# Altium project Digital Clock.PrjPcb
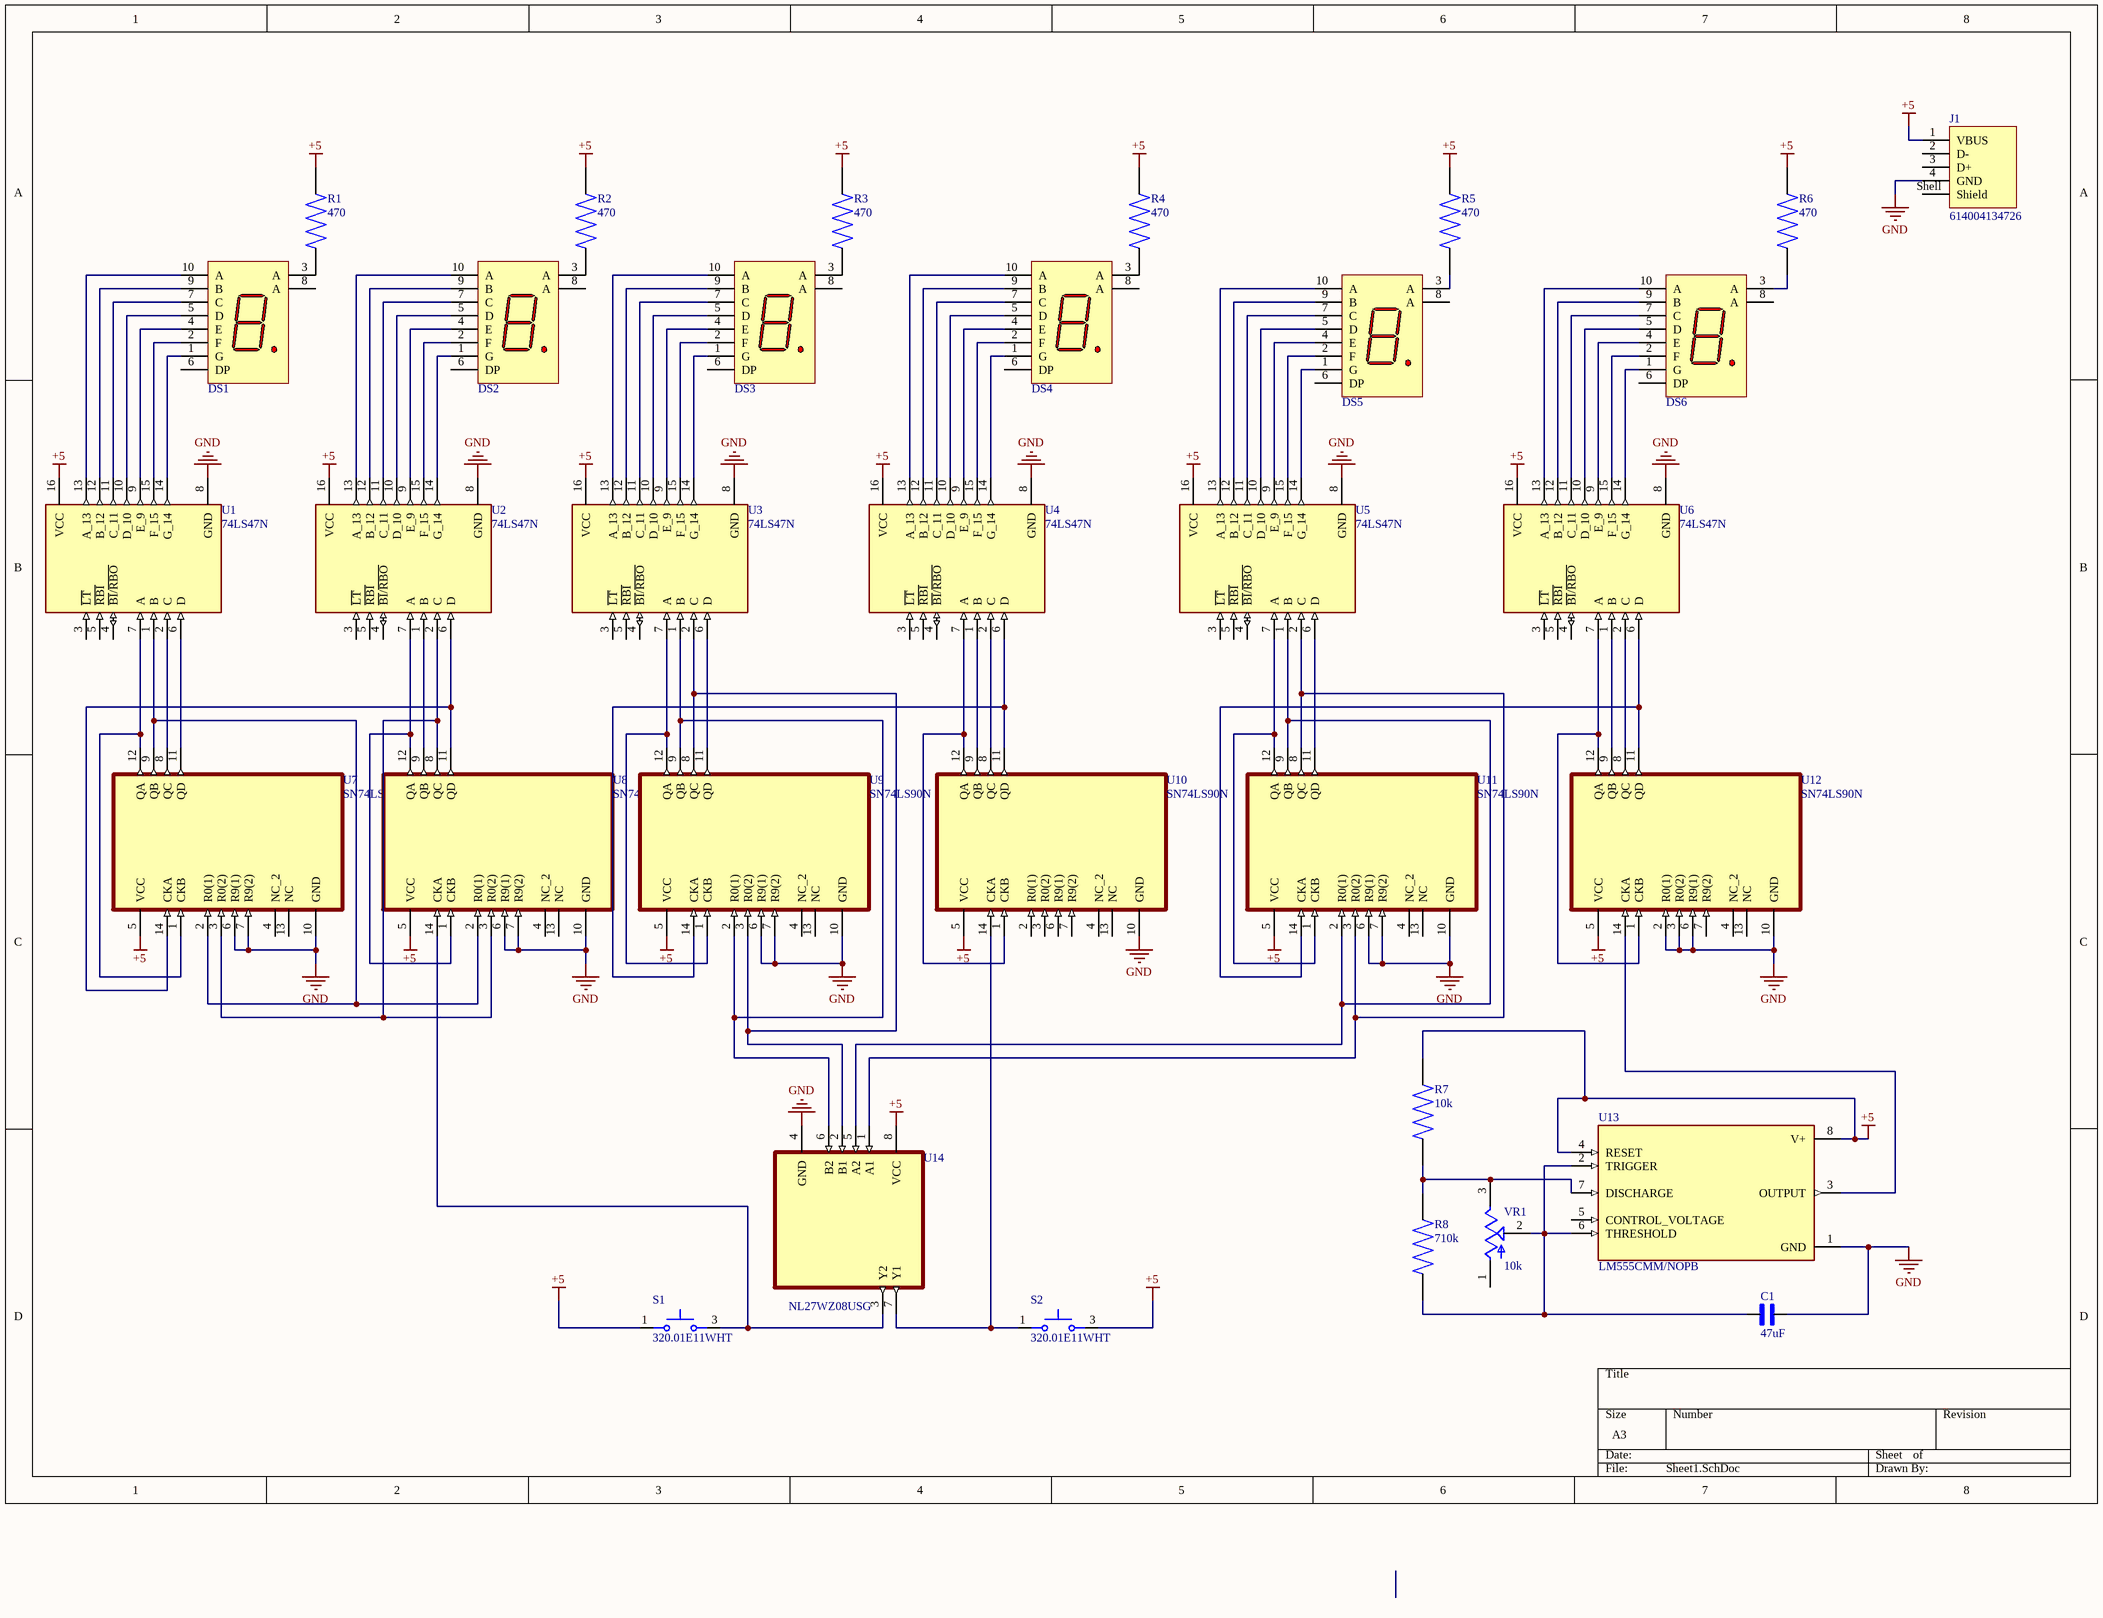
[diagram p0: Sheet1.SchDoc]
1 sheet, 33 parts. Net scope: global (net labels, ports and power ports of the same name join across sheets).
Board file: PCB1.PcbDoc

## Sheet Sheet1.SchDoc
size A3; SheetNumber: 1; SheetTotal: 1

### Parts
C1  value 47uF  [CAPC1608X90N]  (hidden comment: 0603YC104KAZ2A)
DS1  157119S12801  [WL-T7DS_L13W10H7]  (value not drawn)
DS2  157119S12801  [WL-T7DS_L13W10H7]  (value not drawn)
DS3  157119S12801  [WL-T7DS_L13W10H7]  (value not drawn)
DS4  157119S12801  [WL-T7DS_L13W10H7]  (value not drawn)
DS5  157119S12801  [WL-T7DS_L13W10H7]  (value not drawn)
DS6  157119S12801  [WL-T7DS_L13W10H7]  (value not drawn)
J1  614004134726  [614004134726]
R1  value 470  [RES_ERJU01F2202C]  (hidden comment: ERJU01F2202C)
R2  value 470  [RES_ERJU01F2202C]  (hidden comment: ERJU01F2202C)
R3  value 470  [RES_ERJU01F2202C]  (hidden comment: ERJU01F2202C)
R4  value 470  [RES_ERJU01F2202C]  (hidden comment: ERJU01F2202C)
R5  value 470  [RES_ERJU01F2202C]  (hidden comment: ERJU01F2202C)
R6  value 470  [RES_ERJU01F2202C]  (hidden comment: ERJU01F2202C)
R7  value 10k  [RES_ERJU01F2202C]  (hidden comment: ERJU01F2202C)
R8  value 710k  [RES_ERJU01F2202C]  (hidden comment: ERJU01F2202C)
S1  320.01E11WHT  [SW_320.01E11WHT]
S2  320.01E11WHT  [SW_320.01E11WHT]
U1  74LS47N  [DIP794W45P254L1930H508Q16]
U2  74LS47N  [DIP794W45P254L1930H508Q16]
U3  74LS47N  [DIP794W45P254L1930H508Q16]
U4  74LS47N  [DIP794W45P254L1930H508Q16]
U5  74LS47N  [DIP794W45P254L1930H508Q16]
U6  74LS47N  [DIP794W45P254L1930H508Q16]
U7  SN74LS90N  [DIP254P762X508-14]
U8  SN74LS90N  [DIP254P762X508-14]
U9  SN74LS90N  [DIP254P762X508-14]
U10  SN74LS90N  [DIP254P762X508-14]
U11  SN74LS90N  [DIP254P762X508-14]
U12  SN74LS90N  [DIP254P762X508-14]
U13  LM555CMM/NOPB  [SOP65P490X110-8N]
U14  NL27WZ08USG  [SOP50P310X90-8N]
VR1  value 10k  [TRIM_3362P-1-223LF]  (hidden comment: 3362P-1-223LF)

### Nets
+5: J1.1(VBUS) R1.2 R2.2 R3.2 R4.2 R5.2 R6.2 R7.2 S1.1 S2.3 U1.16(VCC) U2.16(VCC) U3.16(VCC) U4.16(VCC) U5.16(VCC) U6.16(VCC) U7.5(VCC) U8.5(VCC) U9.5(VCC) U10.5(VCC) U11.5(VCC) U12.5(VCC) U13.4(RESET) U13.8(V+) U14.8(VCC)
GND: C1.2 J1.4(GND) U1.8(GND) U2.8(GND) U3.8(GND) U4.8(GND) U5.8(GND) U6.8(GND) U7.6(R9(1)) U7.7(R9(2)) U7.10(GND) U8.6(R9(1)) U8.7(R9(2)) U8.10(GND) U9.6(R9(1)) U9.7(R9(2)) U9.10(GND) U10.10(GND) U11.6(R9(1)) U11.7(R9(2)) U11.10(GND) U12.2(R0(1)) U12.3(R0(2)) U12.6(R9(1)) U12.10(GND) U13.1(GND) U14.4(GND)
NetC1_1: C1.1 R8.1 U13.2(TRIGGER) U13.6(THRESHOLD) VR1.2(WIPER)
NetDS1_1: DS1.1(G) U1.14(G_14)
NetDS1_2: DS1.2(F) U1.15(F_15)
NetDS1_3: DS1.3(A) R1.1
NetDS1_4: DS1.4(E) U1.9(E_9)
NetDS1_5: DS1.5(D) U1.10(D_10)
NetDS1_7: DS1.7(C) U1.11(C_11)
NetDS1_9: DS1.9(B) U1.12(B_12)
NetDS1_10: DS1.10(A) U1.13(A_13)
NetDS2_1: DS2.1(G) U2.14(G_14)
NetDS2_2: DS2.2(F) U2.15(F_15)
NetDS2_3: DS2.3(A) R2.1
NetDS2_4: DS2.4(E) U2.9(E_9)
NetDS2_5: DS2.5(D) U2.10(D_10)
NetDS2_7: DS2.7(C) U2.11(C_11)
NetDS2_9: DS2.9(B) U2.12(B_12)
NetDS2_10: DS2.10(A) U2.13(A_13)
NetDS3_1: DS3.1(G) U3.14(G_14)
NetDS3_2: DS3.2(F) U3.15(F_15)
NetDS3_3: DS3.3(A) R3.1
NetDS3_4: DS3.4(E) U3.9(E_9)
NetDS3_5: DS3.5(D) U3.10(D_10)
NetDS3_7: DS3.7(C) U3.11(C_11)
NetDS3_9: DS3.9(B) U3.12(B_12)
NetDS3_10: DS3.10(A) U3.13(A_13)
NetDS4_1: DS4.1(G) U4.14(G_14)
NetDS4_2: DS4.2(F) U4.15(F_15)
NetDS4_3: DS4.3(A) R4.1
NetDS4_4: DS4.4(E) U4.9(E_9)
NetDS4_5: DS4.5(D) U4.10(D_10)
NetDS4_7: DS4.7(C) U4.11(C_11)
NetDS4_9: DS4.9(B) U4.12(B_12)
NetDS4_10: DS4.10(A) U4.13(A_13)
NetDS5_1: DS5.1(G) U5.14(G_14)
NetDS5_2: DS5.2(F) U5.15(F_15)
NetDS5_3: DS5.3(A) R5.1
NetDS5_4: DS5.4(E) U5.9(E_9)
NetDS5_5: DS5.5(D) U5.10(D_10)
NetDS5_7: DS5.7(C) U5.11(C_11)
NetDS5_9: DS5.9(B) U5.12(B_12)
NetDS5_10: DS5.10(A) U5.13(A_13)
NetDS6_1: DS6.1(G) U6.14(G_14)
NetDS6_2: DS6.2(F) U6.15(F_15)
NetDS6_3: DS6.3(A) R6.1
NetDS6_4: DS6.4(E) U6.9(E_9)
NetDS6_5: DS6.5(D) U6.10(D_10)
NetDS6_7: DS6.7(C) U6.11(C_11)
NetDS6_9: DS6.9(B) U6.12(B_12)
NetDS6_10: DS6.10(A) U6.13(A_13)
NetR7_1: R7.1 R8.2 U13.7(DISCHARGE) VR1.3(CW)
NetS1_3: S1.3 U8.14(CKA) U14.3(Y2)
NetS2_1: S2.1 U10.14(CKA) U14.7(Y1)
NetU1_1: U1.1(B) U7.2(R0(1)) U7.9(QB) U8.2(R0(1))
NetU1_2: U1.2(C) U7.8(QC)
NetU1_6: U1.6(D) U7.11(QD)
NetU1_7: U1.7(A) U7.1(CKB) U7.12(QA)
NetU2_1: U2.1(B) U8.9(QB)
NetU2_2: U2.2(C) U7.3(R0(2)) U8.3(R0(2)) U8.8(QC)
NetU2_6: U2.6(D) U7.14(CKA) U8.11(QD)
NetU2_7: U2.7(A) U8.1(CKB) U8.12(QA)
NetU3_1: U3.1(B) U9.2(R0(1)) U9.9(QB) U14.6(B2)
NetU3_2: U3.2(C) U9.3(R0(2)) U9.8(QC) U14.2(B1)
NetU3_6: U3.6(D) U9.11(QD)
NetU3_7: U3.7(A) U9.1(CKB) U9.12(QA)
NetU4_1: U4.1(B) U10.9(QB)
NetU4_2: U4.2(C) U10.8(QC)
NetU4_6: U4.6(D) U9.14(CKA) U10.11(QD)
NetU4_7: U4.7(A) U10.1(CKB) U10.12(QA)
NetU5_1: U5.1(B) U11.2(R0(1)) U11.9(QB) U14.5(A2)
NetU5_2: U5.2(C) U11.3(R0(2)) U11.8(QC) U14.1(A1)
NetU5_6: U5.6(D) U11.11(QD)
NetU5_7: U5.7(A) U11.1(CKB) U11.12(QA)
NetU6_1: U6.1(B) U12.9(QB)
NetU6_2: U6.2(C) U12.8(QC)
NetU6_6: U6.6(D) U11.14(CKA) U12.11(QD)
NetU6_7: U6.7(A) U12.1(CKB) U12.12(QA)
NetU12_14: U12.14(CKA) U13.3(OUTPUT)

Not connected (* = marked no-connect by the designer): DS1 6(DP) 8(A); DS2 6(DP) 8(A); DS3 6(DP) 8(A); DS4 6(DP) 8(A); DS5 6(DP) 8(A); DS6 6(DP) 8(A); J1 2(D-) 3(D+) Shell(Shield); U1 3(~{LT}) 4(~{BI}/~{RBO}) 5(~{RBI}); U2 3(~{LT}) 4(~{BI}/~{RBO}) 5(~{RBI}); U3 3(~{LT}) 4(~{BI}/~{RBO}) 5(~{RBI}); U4 3(~{LT}) 4(~{BI}/~{RBO}) 5(~{RBI}); U5 3(~{LT}) 4(~{BI}/~{RBO}) 5(~{RBI}); U6 3(~{LT}) 4(~{BI}/~{RBO}) 5(~{RBI}); U7 4(NC_2) 13(NC); U8 4(NC_2) 13(NC); U9 4(NC_2) 13(NC); U10 2(R0(1)) 3(R0(2)) 4(NC_2) 6(R9(1)) 7(R9(2)) 13(NC); U11 4(NC_2) 13(NC); U12 4(NC_2) 7(R9(2)) 13(NC); U13 5(CONTROL_VOLTAGE); VR1 1(CCW)

### Library data of the parts
C1 = 0603YC104KAZ2A: Capacitor MLCC 0603 100nF 16V | AVX 0603YC104KAZ2A; SnapEDA_Link: https://www.snapeda.com/parts/0603YC104KAZ2A/AVX/view-part/?ref=snap; Package: 1608 AVX; MF: AVX; MP: 0603YC104KAZ2A; Check_prices: https://www.snapeda.com/parts/0603YC104KAZ2A/AVX/view-part/?ref=eda
DS1-DS6 = 157119S12801: WL-T7DS 7 Segments Display THT Single Digit, 0.39"/ 9.9mm, Common Anode, 38mcd, 2V, Super Red; Manufacturer: Wurth Elektronik; ComponentLink1Description: Website Link; ComponentLink1URL: https://www.we-online.com/redexpert/article/157119S12801?ad; ComponentLink2Description: Datasheet Link; ComponentLink2URL: https://www.we-online.com/redexpert/spec/157119S12801?ad; Manufacturer Part Number: 157119S12801; Category: 7 Segments Display; Match Code: WL-T7DS; Mount: Through Hole; Operating Temperature Max: 85°C; Operating Temperature Min: -40°C; Packaging: Tube; Length: 13mm; Width: 10mm; Height: 7mm; Circuitry: Common Anode; Display Height: 0.39"/ 9.9mm; Emitting Color: Super Red; Forward Voltage: 2V; Luminous Intensity: 38mcd
J1 = 614004134726: WR-COM USB 2.0 Type A Up Right; Manufacturer: Wurth Elektronik; Match Code: WR-USB; Gender: Receptacle; Interface Type: Type A; Number of Ports: 1; Rated Current: 1.5; Working Voltage: 30V (AC); Manufacturer Part Number: 614004134726; Category: Input/Output Connector; ComponentLink1Description: Website Link; ComponentLink1URL: https://www.we-online.com/redexpert/article/614004134726?ad; ComponentLink2Description: Datasheet Link; ComponentLink2URL: https://www.we-online.com/redexpert/spec/614004134726?ad; Mount: Through Hole; Operating Temperature Min: -40degC; Operating Temperature Max: 105degC; Packaging: Tray; Application: USB 2.0; Number of Pins: 4; Orientation: Up Right
S1 S2 = 320.01E11WHT: PUSHBUTTON, 25mA, 50VDC SPST-NO, Off-(On) Through Hole; MF: E-Switch; SnapEDA_Link: https://www.snapeda.com/parts/320.01E11WHT/E-Switch/view-part/?ref=snap; Package: None; Value: *; MP: 320.01E11WHT; Check_prices: https://www.snapeda.com/parts/320.01E11WHT/E-Switch/view-part/?ref=eda
U1-U6 = 74LS47N: IC DRVR BCD-7 SEGMENT 16SO; MF: Texas Instruments; SnapEDA_Link: https://www.snapeda.com/parts/74LS47N/Texas+Instruments/view-part/?ref=snap; Package: PDIP-16 Texas Instruments; Value: *; MP: 74LS47N; Check_prices: https://www.snapeda.com/parts/74LS47N/Texas+Instruments/view-part/?ref=eda
U7-U12 = SN74LS90N: Counter IC Counter, Decade 1 Element 4 Bit Negative Edge 14-SOIC; MF: Texas Instruments; MP: 74LS90; SnapEDA_Link: https://www.snapeda.com/parts/74LS90/Texas+Instruments/view-part/?ref=snap; Package: SOIC-14 Texas Instruments; Value: *; Check_prices: https://www.snapeda.com/parts/74LS90/Texas+Instruments/view-part/?ref=eda
U13 = LM555CMM/NOPB: Highly Stable 555 Timer; MF: Texas Instruments; SnapEDA_Link: https://www.snapeda.com/parts/LM555CMM/NOPB/Texas+Instruments/view-part/?ref=snap; Package: VSSOP-8 Texas Instruments; Value: *; MP: LM555CMM/NOPB; Check_prices: https://www.snapeda.com/parts/LM555CMM/NOPB/Texas+Instruments/view-part/?ref=eda
U14 = NL27WZ08USG: NL27WZ08USG, Dual 2-Input AND Logic Gate, 1.65 - 5.5 V, 8-Pin US | ON Semiconductor NL27WZ08USG; SnapEDA_Link: https://www.snapeda.com/parts/NL27WZ08USG/Onsemi/view-part/?ref=snap; Package: US-8 ON Semiconductor; Value: *; MF: ON Semiconductor; MP: NL27WZ08USG; Check_prices: https://www.snapeda.com/parts/NL27WZ08USG/Onsemi/view-part/?ref=eda
VR1 = 3362P-1-223LF: Res Cermet Trimmer 22K Ohm 10% 0.5W(1/2W) 1(Elec)/1(Mech)Turn 2.77mm (6.6 X 6.99 X 4.7mm) Pin Thru-Hole Tube; MF: Bourns Electronics; MP: 3362P1223LF; SnapEDA_Link: https://www.snapeda.com/parts/3362P1223LF/Bourns/view-part/?ref=snap; Package: 3362P-1 Bourns Inc.; Check_prices: https://www.snapeda.com/parts/3362P1223LF/Bourns/view-part/?ref=eda
R1-R8 = ERJU01F2202C: Package: None; Availability: Unavailable; MP: ERJU01F2202C; Price: None